# Altium schematic sheet CW340_PSU_VCCIO.SchDoc: VCCIO Fixed Supplies
size Letter; Organization: NewAE Technology Inc.; Address1: 1083 Queen St., Suite 196; Address2: Halifax; Address3: NS; Address4: Canada B3H 0B2; DocumentNumber: .; Revision: .; SheetNumber: 22; SheetTotal: 31; SheetApproved: Yes
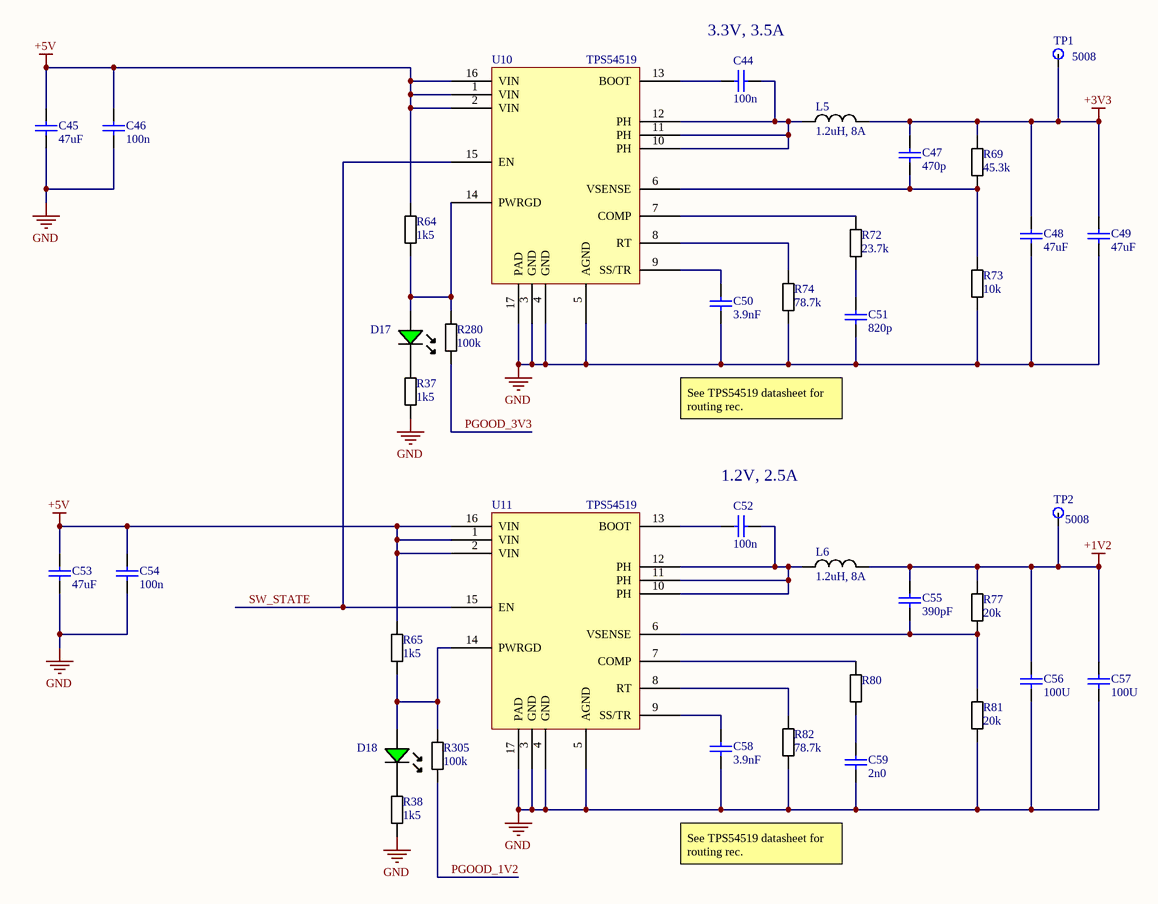
[diagram p0: CW340_PSU_VCCIO.SchDoc]

## Parts
C44  100n  [CAPC0603_M]
C45  47uF  [CAPC3225X20N]
C46  100n  [CAPC0603_M]
C47  470p  [RESC1608X55N]
C48  47uF  [CAPC3225X20N]
C49  47uF  [CAPC3225X20N]
C50  3.9nF  [CAPC0603_M]
C51  820p  [RESC1608X55N]
C52  100n  [CAPC0603_M]
C53  47uF  [CAPC3225X20N]
C54  100n  [CAPC0603_M]
C55  390pF  [CAPC0603_M]
C56  100U  [CAPC1206_M]
C57  100U  [CAPC1206_M]
C58  3.9nF  [CAPC0603_M]
C59  2n0  [CAPC0603_M]
D17  LED, 0603, Green  [LED-0603-GREEN]  (value not drawn)
D18  LED, 0603, Green  [LED-0603-GREEN]  (value not drawn)
L5  1.2uH, 8A  [XAL5030-122]
L6  1.2uH, 8A  [XAL5030-122]
R37  1k5  [RESC1608X55N]
R38  1k5  [RESC1608X55N]
R64  1k5  [RESC1608X55N]
R65  1k5  [RESC1608X55N]
R69  45.3k  [RESC1608X55N]
R72  23.7k  [RESC1608X55N]
R73  10k  [RESC1608X55N]
R74  78.7k  [RESC1608X55N]
R77  20k  [RESC1608X55N]
R80  (no value)  [RESC1608X55N]
R81  20k  [RESC1608X55N]
R82  78.7k  [RESC1608X55N]
R280  100k  [RESC1608X55N]
R305  100k  [RESC1608X55N]
TP1  5008  [KEYSTONE5008]
TP2  5008  [KEYSTONE5008]
U10  TPS54519  [QFN50P300X300X80_HS-17N]
U11  TPS54519  [QFN50P300X300X80_HS-17N]

## Nets
+1V2: C55.1 C56.1 C57.1 L6.2 R77.1 TP2.1
+3V3: C47.2 C48.1 C49.1 L5.2 R69.1 TP1.1
+5V: C45.1 C46.2 C53.1 C54.2 R64.1 R65.1 U10.1(VIN) U10.2(VIN) U10.16(VIN) U11.1(VIN) U11.2(VIN) U11.16(VIN)
GND: C45.2 C46.1 C48.2 C49.2 C50.2 C51.2 C53.2 C54.1 C56.2 C57.2 C58.2 C59.2 R37.2 R38.2 R73.2 R74.2 R81.2 R82.2 U10.3(GND) U10.4(GND) U10.5(AGND) U10.17(PAD) U11.3(GND) U11.4(GND) U11.5(AGND) U11.17(PAD)
PGOOD_1V2: R305.2
PGOOD_3V3: R280.2
SW_STATE: U10.15(EN) U11.15(EN)
NetC44_1: C44.1 U10.13(BOOT)
NetC44_2: C44.2 L5.1 U10.10(PH) U10.11(PH) U10.12(PH)
NetC47_1: C47.1 R69.2 R73.1 U10.6(VSENSE)
NetC50_1: C50.1 U10.9(SS/TR)
NetC51_1: C51.1 R72.2
NetC52_1: C52.1 U11.13(BOOT)
NetC52_2: C52.2 L6.1 U11.10(PH) U11.11(PH) U11.12(PH)
NetC55_2: C55.2 R77.2 R81.1 U11.6(VSENSE)
NetC58_1: C58.1 U11.9(SS/TR)
NetC59_1: C59.1 R80.2
NetD17_A: D17.A R64.2 R280.1 U10.14(PWRGD)
NetD17_K: D17.K R37.1
NetD18_A: D18.A R65.2 R305.1 U11.14(PWRGD)
NetD18_K: D18.K R38.1
NetR72_1: R72.1 U10.7(COMP)
NetR74_1: R74.1 U10.8(RT)
NetR80_1: R80.1 U11.7(COMP)
NetR82_1: R82.1 U11.8(RT)

## Notes on the sheet
- (near C44) 3.3V, 3.5A
- See TPS54519 datasheet for routing rec.
- (near C52) 1.2V, 2.5A
- Title:
- Date:
- Rev:
- Time:
- Project:
- Sheet
- of
- License:
- Copyright © NewAE Technology Inc.
- Approved:
- NewAE.com
- File:

## Library data of the parts
C44 C46 C52 C54 = CCHIP-100n-0603: 100n, 0603; Manufacture 1: Kemet; Manufacture Part Number 1: C0603C104K5RACTU; Component Group: Capacitor; Case-EIA: 0603; Case-Metric: 1608; Rated Voltage: 50VDC; Part Number: CCHIP-100n-0603; Footprint: 0603; Pin Count: 2; Supplier 1: Digi-Key; Supplier Part Number 1: 399-5089-2-ND; LCSC Equivalent: C1591; Value: 100n; Mounting Technology: SMT; Component Kind: Standard; Component Type: Standard
C45 C48 C49 C53 = CCHIP-47u-1210: 47u, 10V, 1210, Ceramic; Manufacture 1: TDK Corporation; Manufacture Part Number 1: C3225X5R1A476M250AC; Component Group: Capacitor; Case-EIA: 1210; Case-Metric: 3225; Rated Voltage: 10VDC; Tolerance: 20%; Part Number: CCHIP-47u-1210; Footprint: 1210; Pin Count: 2; Supplier 1: Digi-Key; Supplier Part Number 1: 445-6711-1-ND; Value: 47uF; Mounting Technology: SMT; Temperature Range: -55C to 85C; Component Kind: Standard; Component Type: Standard
C47 = CCHIP-470P-0603-100V: CAP CER 470PF 100V X7R 0603; Manufacture 1: Murata Electronics North America; Manufacture Part Number 1: GRM188R72A471KA01D; Component Group: Capacitor; Case-EIA: 0603; Case-Metric: 1608; Tolerance: ±10%; PP Material Stack: 0; Part Number: CCHIP-470P-0603-100V; Footprint: 0603; Pin Count: 2; Supplier 1: Digi-Key; Supplier Part Number 1: 490-1467-1-ND; Value: 470p; Rated Voltage: 100V; Mounting Technology: SMT; Component Kind: Standard; Component Type: Standard; PP Rotation: 0
C50 C58 = CCHIP-3n9-0603: 3n9, 0603; Manufacture 1: Murata; Manufacture Part Number 1: GCM1885C1H392FA16J; Component Group: Capacitor; Case-EIA: 0603; Case-Metric: 1608; PP Material Stack: 0; Tolerance: 1%; Part Number: CCHIP-3n9-0603; Footprint: 0603; Pin Count: 2; Value: 3.9nF; Mounting Technology: SMT; Component Kind: Standard; Component Type: Standard; PP Rotation: 0; Supplier 1: Digi-Key; Supplier Part Number 1: 490-GCM1885C1H392FA16JCT-ND
C51 = CCHIP-820P-0603-100V: CAP CER 820PF 100V X7R 0603; Manufacture 1: Murata Electronics North America; Manufacture Part Number 1: GRM188R72A821KA01D; Component Group: Capacitor; Case-EIA: 0603; Case-Metric: 1608; Tolerance: ±10%; PP Material Stack: 0; Part Number: CCHIP-820P-0603-100V; Footprint: 0603; Pin Count: 2; Supplier 1: Digi-Key; Supplier Part Number 1: 490-1471-1-ND; Value: 820p; Rated Voltage: 100V; Mounting Technology: SMT; Component Kind: Standard; Component Type: Standard; PP Rotation: 0
C55 = CCHIP-390p-0603-C0G: 390p, 0603, C0G/NP0; Manufacture Part Number 1: GCM1885C2A391JA16D; Component Group: Capacitor; Case-EIA: 0603; Case-Metric: 1608; Rated Voltage: 50V; Tolerance: 5%; PP Material Stack: 0; Part Number: CCHIP-390p-0603-C0G; Footprint: 0603; Pin Count: 2; Supplier 1: Digi-Key; Value: 390pF; Mounting Technology: SMT; Component Kind: Standard; Component Type: Standard; PP Rotation: 0; Supplier Part Number 1: 490-17768-1-ND
C56 C57 = CCHIP-100u-1206-6.3v: CAP CER 100UF 6.3V X5R 1206; Manufacture 1: Murata Electronics; Manufacture Part Number 1: GRM31CR60J107ME39L; Component Group: Capacitor; Case-EIA: 1206; Case-Metric: 3216; Rated Voltage: 6.3VDC; Part Number: CCHIP-100u-1206-6.3v; Footprint: 1206; Pin Count: 2; Supplier 1: Digi-Key; Supplier Part Number 1: 490-4539-2-ND; Value: 100U; Mounting Technology: SMT; Component Kind: Standard; Component Type: Standard
C59 = CCHIP-2n-0603-C0G: 2n, 0603, C0G/NP0; Manufacture Part Number 1: GCM1885C1H202FA16J; Component Group: Capacitor; Case-EIA: 0603; Case-Metric: 1608; Rated Voltage: 50V; Tolerance: 1%; Part Number: CCHIP-2n-0603-C0G; Footprint: 0603; Pin Count: 2; Supplier 1: Digi-Key; Value: 2n0; Mounting Technology: SMT; Component Kind: Standard; Component Type: Standard; Supplier Part Number 1: 490-GCM1885C1H202FA16JCT-ND
D17 D18 = LEDCHIP_0603_GREEN: Chip LED, Green; Manufacture 1: Kingbright; Manufacture Part Number 1: APT1608CGCK; Component Group: Optical; PP Material Stack: 16; PP Rotation: -90; Part Number: LEDCHIP_0603_GREEN; Pin Count: 2; Supplier 1: Digi-Key; Supplier Part Number 1: 754-1116-1-ND; Mounting Technology: SMT; Component Kind: Standard; Component Type: Standard
L5 L6 = XAL5030-122: 1.2uH, 8A RMS, 12A SAT; Manufacture 1: Coilcraft; Manufacture Part Number 1: XAL5030-122MEB; Component Group: Inductor; PP Material Stack: 0; Part Number: XAL5030-122; Footprint: XAL5030; Pin Count: 2; Supplier 1: Mouser; Value: 1.2uH, 8A; Mounting Technology: SMT; Component Kind: Standard; Component Type: Standard; PP Rotation: 0
R37 R38 R64 R65 = RCHIP-1K5-0603: 1k5 res, 0603, 1%, 1/10W; Manufacture 1: Yageo; Manufacture Part Number 1: RC0603FR-071K5L; Component Group: Resistor; Case-EIA: 0603; Case-Metric: 1608; Rated Power: 0.1W; Rated Voltage: 75VDC; Part Number: RCHIP-1K5-0603; Footprint: 0603; Pin Count: 2; Supplier 1: Digi-Key; Supplier Part Number 1: 311-1.50KHRCT-ND; Value: 1k5; Tolerance: 1%; Mounting Technology: SMT; Temperature Range: -55C to 155C; Component Kind: Standard; Component Type: Standard
R69 = RCHIP-45K3-0603: 45k3 res, 0603, 1%, 1/10W; Manufacture 1: Yageo; Manufacture Part Number 1: RC0603FR-0745K3L; Component Group: Resistor; Case-EIA: 0603; Case-Metric: 1608; Rated Power: 0.1W; Rated Voltage: 75VDC; Part Number: RCHIP-45K3-0603; Footprint: 0603; Pin Count: 2; Supplier 1: Digi-Key; Supplier Part Number 1: 311-45.3KHRCT-ND; Value: 45.3k; Tolerance: 1%; Mounting Technology: SMT; Temperature Range: -55C to 155C; Component Kind: Standard; Component Type: Standard
R72 = RCHIP-23k7-0603: 23k7 res, 0603, 1%, 1/10W; Manufacture 1: Yageo; Manufacture Part Number 1: RC0603FR-0723K7L; Component Group: Resistor; Case-EIA: 0603; Case-Metric: 1608; Rated Power: 0.1W; Rated Voltage: 75VDC; Part Number: RCHIP-23k7-0603; Footprint: 0603; Pin Count: 2; Supplier 1: Digi-Key; Value: 23.7k; Tolerance: 1%; Mounting Technology: SMT; Temperature Range: -55C to 155C; Component Kind: Standard; Component Type: Standard; Supplier Part Number 1: 311-23.7KHRCT-ND
R73 = RCHIP-10K-0603: 10k res, 0603, 1%, 1/10W; Manufacture 1: Yageo; Manufacture Part Number 1: RC0603FR-0710KL; Component Group: Resistor; Case-EIA: 0603; Case-Metric: 1608; Rated Power: 0.1W; Rated Voltage: 75VDC; Part Number: RCHIP-10K-0603; Footprint: 0603; Pin Count: 2; Supplier 1: Digi-Key; Supplier Part Number 1: 311-10.0KHRCT-ND; Value: 10k; Tolerance: 1%; Mounting Technology: SMT; Temperature Range: -55C to 155C; Component Kind: Standard; Component Type: Standard
R74 R82 = RCHIP-78k7-0603: 78k7 res, 0603, 1%, 1/10W; Manufacture 1: Yageo; Manufacture Part Number 1: RC0603FR-078K7L; Component Group: Resistor; Case-EIA: 0603; Case-Metric: 1608; Rated Power: 0.1W; Rated Voltage: 75VDC; Part Number: RCHIP-78k7-0603; Footprint: 0603; Pin Count: 2; Supplier 1: Digi-Key; Value: 78.7k; Tolerance: 1%; Mounting Technology: SMT; Temperature Range: -55C to 155C; Component Kind: Standard; Component Type: Standard; Supplier Part Number 1: 311-78.7KHRCT-ND
R77 R81 = RCHIP-20K-0603: 20k res, 0603, 1%, 1/10W; Manufacture 1: Yageo; Manufacture Part Number 1: RC0603FR-0720KL; Component Group: Resistor; Case-EIA: 0603; Case-Metric: 1608; Rated Power: 0.1W; Rated Voltage: 75VDC; Part Number: RCHIP-20K-0603; Footprint: 0603; Pin Count: 2; Supplier 1: Digi-Key; Supplier Part Number 1: 311-20.0KHRCT-ND; Value: 20k; Tolerance: 1%; Mounting Technology: SMT; Temperature Range: -55C to 155C; Component Kind: Standard; Component Type: Standard
R80 = RCHIP-12k1-0603: 12k1 res, 0603, 1%, 1/10W; Manufacture 1: Yageo; Manufacture Part Number 1: RC0603FR-0712K1L; Component Group: Resistor; Case-EIA: 0603; Case-Metric: 1608; Rated Power: 0.1W; Rated Voltage: 75VDC; Part Number: RCHIP-12k1-0603; Footprint: 0603; Pin Count: 2; Supplier 1: Digi-Key; Tolerance: 1%; Mounting Technology: SMT; Temperature Range: -55C to 155C; Component Kind: Standard; Component Type: Standard; Supplier Part Number 1: 311-12.1KHRCT-ND
R280 R305 = RCHIP-100K-0603: 100k res, 0603, 1%, 1/10W; Manufacture 1: Yageo; Manufacture Part Number 1: RC0603FR-07100KL; Component Group: Resistor; Case-EIA: 0603; Case-Metric: 1608; Rated Power: 0.1W; Rated Voltage: 75VDC; Part Number: RCHIP-100K-0603; Footprint: 0603; Pin Count: 2; Supplier 1: Digi-Key; Supplier Part Number 1: 311-100KHRCT-ND; Value: 100k; Tolerance: 1%; Mounting Technology: SMT; Temperature Range: -55C to 155C; Component Kind: Standard; Component Type: Standard
TP1 TP2 = KEYSTONE_5008: TEST POINT PC COMPACT .063"D ORG; Part Number: KEYSTONE_5008; Component Group: Test Point; Pin Count: 1; Supplier 1: Digi-Key; Supplier Part Number 1: 36-5008-ND; Mounting Technology: Through-hole; Component Kind: Standard; Component Type: Standard
U10 U11 = TPS54519: 6V Input, 5A, SMPS; Manufacture 1: Texas Instruments; Component Group: Analog IC; PP Material Stack: 0; Part Number: TPS54519; Footprint: 16-QFN; Manufacture Part Number 1: TPS54519; Pin Count: 17; Component Kind: Standard; Component Type: Standard; PP Rotation: 0; Mounting Technology: SMT